# EasyEDA Pro project ProPrj_BSPD_2025-08-26.epro, board PCB1
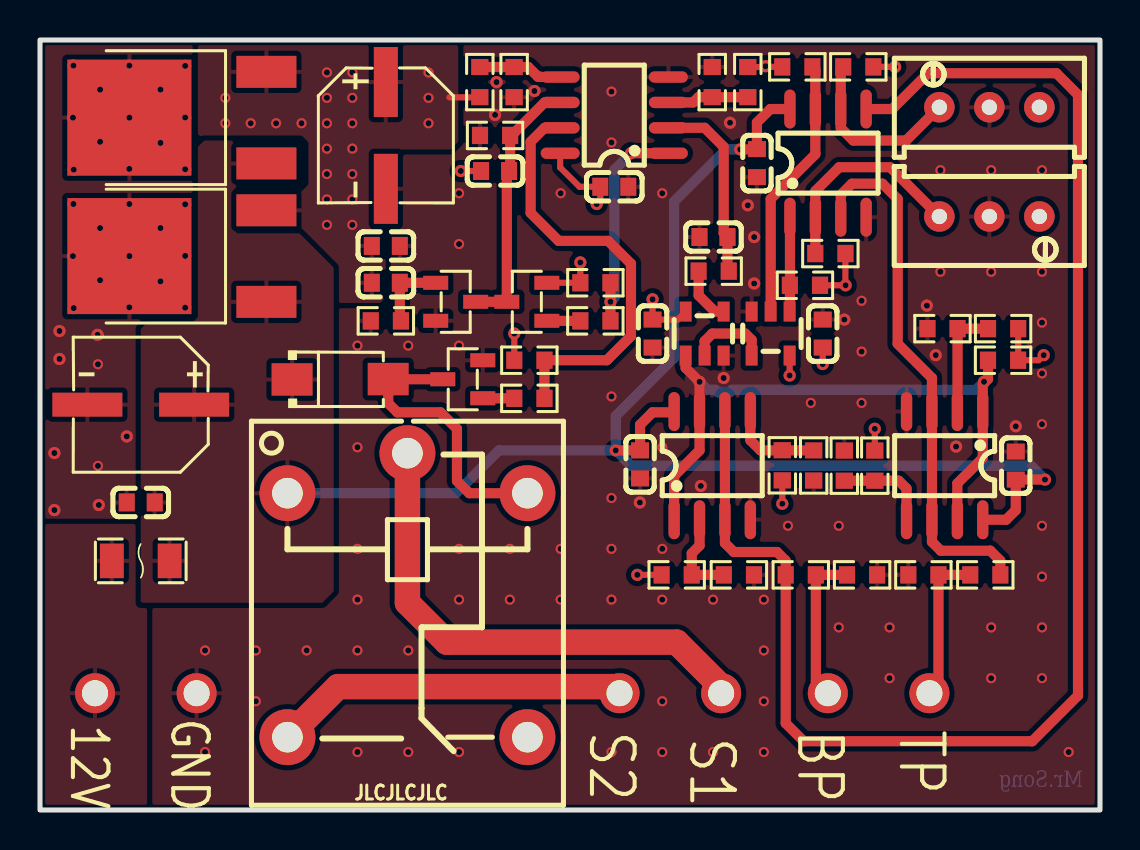
[diagram p2: board, top side]
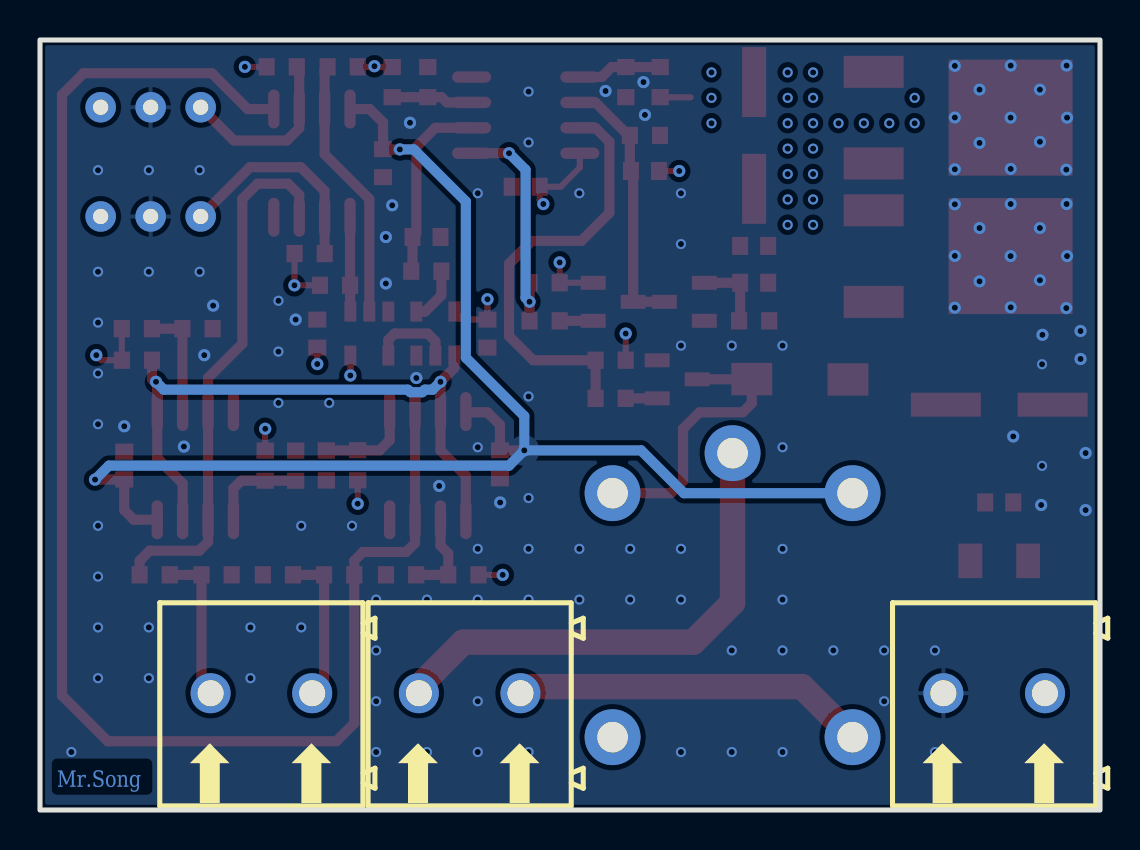
[diagram p3: board, bottom side, seen from below]

Outline 53 x 38.5 mm; copper layers: Top Layer, GND, 5V, Bottom Layer. Coordinates in mm from the lower left corner of the outline.
Outline path: rectangle 0,38.5 53,0
Stack: Top Layer 0.035mm 外层铜厚1oz / Dielectric1 0.2104mm 7628 RC49% 8.6mil / GND 0.0152mm 内层铜厚 / Dielectric2 1.065mm 1.1mm H/HOZ 含铜 / 5V 0.0152mm 内层铜厚 / Dielectric3 0.2104mm 7628 RC49% 8.6mil / Bottom Layer 0.035mm 外层铜厚1oz

## Design rules (mm)
template: 自定义配置
spacing copperThickness1oz (default): track to track 0.102, other pairs 0.152 to 0.3
spacing copperThickness2oz: track to track 0.203, other pairs 0.152 to 0.3
track width copperThickness1oz (default): min 0.127, default 0.254, max 2.54
track width copperThickness2oz: min 0.203, default 0.254, max 2.54
differential pair differentialPair (default): width min 0.127, default 0.254, max 2.54; gap min 0.152, default 0.152
via viaSize (default): diameter min 0.5, default 0.61, max 10; hole min 0.3, default 0.305, max 6.3

## Placement (name value [footprint] x y rotation side)
C1  100nF  [C0603]  48.79 17.22 90 top
C2  100nF  [C0603]  30 17.28 270 top
C5  100nF  [C0603]  5.04 15.38 0 top
C6  100nF  [C0603]  17.29 28.2 0 top
C7  100nF  [C0603]  35.85 32.34 270 top
C8  100nF  [C0603]  39.14 23.82 90 top
C9  100nF  [C0603]  30.63 23.82 270 top
C10  10uF  [C0603]  33.67 28.65 0 top
C11  100nF  [C0603]  28.71 31.16 0 top
C12  10uF  [C0603]  22.75 31.95 180 top
C13  100nF  [C0603]  17.29 26.36 180 top
C14  100uF  [CAP-SMD_BD6.3-L6.6-W6.6-LS7.4-FD]  5.04 20.27 180 top
C15  100uF  [CAP-SMD_BD6.3-L6.6-W6.6-LS7.4-FD]  17.29 33.73 270 top
D1  M4  [SMA_L4.3-W2.6-LS5.0-RD]  15.01 21.54 0 top
F1  nSMD005  [F1206]  5.04 12.46 0 top
P1  WJ500V-5.08-2P  [CONN-TH_2P-P5.00_WJ500V-5.08-2P]  5.29 5.84 0 bottom
P2  WJ500V-5.08-2P  [CONN-TH_2P-P5.00_WJ500V-5.08-2P]  41.93 5.84 0 bottom
P3  WJ500V-5.08-2P  [CONN-TH_2P-P5.00_WJ500V-5.08-2P]  31.52 5.84 0 bottom
Q1  BSS138  [SOT-23-3_L2.9-W1.3-P1.90-LS2.4-BR]  20.78 25.41 180 top
Q2  BSS84  [SOT-23-3_L2.9-W1.3-P1.90-LS2.4-BR-1]  24.34 25.41 0 top
Q3  BSS138  [SOT-23-3_L2.9-W1.3-P1.90-LS2.4-BR]  21.14 21.54 0 top
R1  100kΩ  [R0603]  48.16 24.07 0 top
R2  1kΩ  [R0603]  45.12 24.07 0 top
R3  100kΩ  [R0603]  40.22 17.22 270 top
R4  1kΩ  [R0603]  41.74 17.22 90 top
R5  100kΩ  [R0603]  31.83 11.76 180 top
R6  1kΩ  [R0603]  34.95 11.76 180 top
R7  100kΩ  [R0603]  38.68 17.23 90 top
R8  1kΩ  [R0603]  37.12 17.24 270 top
R9  10kΩ  [R0603]  48.15 22.49 0 top
R14  10kΩ  [RES-ADJ-TH_3P-L10.0-W10.0-P2.50-L]  47.47 29.68 180 top
R16  10kΩ  [RES-ADJ-TH_3P-L10.0-W10.0-P2.50-L]  47.47 35.14 0 top
R17  10kΩ  [R0603]  38.25 26.23 0 top
R18  10kΩ  [R0603]  39.52 27.82 0 top
R19  10kΩ  [R0603]  40.91 37.16 0 top
R20  10kΩ  [R0603]  37.87 37.16 180 top
R21  40.2kΩ  [R0603]  33.68 26.94 0 top
R26  39kΩ  [R0603]  35.39 36.39 90 top
R27  100kΩ  [R0603]  33.61 36.39 270 top
R28  39kΩ  [R0603]  21.99 36.39 270 top
R29  10kΩ  [R0603]  27.77 26.36 180 top
R30  10kΩ  [R0603]  23.71 36.39 90 top
R31  10kΩ  [R0603]  24.47 22.49 180 top
R32  100Ω  [R0603]  27.77 24.46 0 top
R35  1MΩ  [R0603]  22.75 33.73 0 top
R36  750kΩ  [R0603]  17.29 24.46 0 top
R37  100Ω  [R0603]  24.47 20.58 180 top
R38  10kΩ  [R0603]  47.26 11.76 0 top
R39  100kΩ  [R0603]  44.17 11.76 0 top
R40  10kΩ  [R0603]  38.04 11.76 180 top
R41  100kΩ  [R0603]  41.1 11.76 0 top
RELAY1  SRD-12VDC-SL-C  [RELAY-TH_SRD-XXVDC-XL-C]  18.37 10.74 270 top
U1  LM393DR  [SOIC-8_L5.0-W4.0-P1.27-LS6.0-BL]  45.23 17.22 180 top
U5  LM393DR  [SOIC-8_L5.0-W4.0-P1.27-LS6.0-BL]  33.61 17.22 0 top
U7  78M05  [TO-252-2_L6.6-W6.1-P4.57-LS9.9-BR-CW]  7.89 27.7 0 top
U8  SN74LVC1G00DBVR(UMW)  [SOT-23-5_L2.9-W1.6-P0.95-LS2.8-BL]  36.53 23.82 180 top
U9  SN74LVC1G00DBVR(UMW)  [SOT-23-5_L2.9-W1.6-P0.95-LS2.8-BL]  33.23 23.82 0 top
U10  LM393DR  [SOIC-8_L5.0-W4.0-P1.27-LS6.0-BL]  39.4 32.34 0 top
U11  LM393DR  [SOIC-8_L5.0-W4.0-P1.27-LS6.0-BL]  28.71 34.74 90 top
U12  78M05  [TO-252-2_L6.6-W6.1-P4.57-LS9.9-BR-CW]  7.89 34.62 0 top

## Footprints (pads in the part's own frame, mm; a bottom-side part is the same pattern mirrored in y, then rotated)
C0603
  rect 0.8x0.9 smd: 1(-0.7,0) 2(0.7,0)
CAP-SMD_BD6.3-L6.6-W6.6-LS7.4-FD
  rect 3.5x1.2 smd: 1(-2.67,0) 2(2.67,0)
CONN-TH_2P-P5.00_WJ500V-5.08-2P
  round 2 hole 1.3: 1(-2.54,0) 2(2.54,0)
F1206
  rect 1.19x1.728 smd: 1(-1.445,0) 2(1.445,0)
R0603
  rect 0.806x0.864 smd: 1(-0.753,0) 2(0.753,0)
RELAY-TH_SRD-XXVDC-XL-C
  round 2.794 hole 1.524: 1(-5.1,-6) 2(7.1,-6) 3(7.1,6) 4(-5.1,6) 5(-7.1,0)
RES-ADJ-TH_3P-L10.0-W10.0-P2.50-L
  round 1.524 hole 0.762: 1(-2.5,0) 2(0,0) 3(2.5,0)
SMA_L4.3-W2.6-LS5.0-RD
  rect 2.046x1.62 smd: 1(-2.404,-0.009) 2(2.404,0.009)
SOIC-8_L5.0-W4.0-P1.27-LS6.0-BL
  oval 0.569x1.95 smd: 1(-1.905,-2.705) 2(-0.635,-2.705) 3(0.635,-2.705) 4(1.905,-2.705) 5(1.905,2.705) 6(0.635,2.705) 7(-0.635,2.705) 8(-1.905,2.705)
SOT-23-3_L2.9-W1.3-P1.90-LS2.4-BR
  rect 1.25x0.7 smd: 1(1,-0.95) 2(1,0.95) 3(-1,0)
SOT-23-3_L2.9-W1.3-P1.90-LS2.4-BR-1
  rect 1.25x0.7 smd: 1(1,-0.95) 2(1,0.95) 3(-1,0)
SOT-23-5_L2.9-W1.6-P0.95-LS2.8-BL
  rect 0.6x1 smd: 1(-0.95,-1.1) 2(0,-1.1) 3(0.95,-1.1) 4(0.95,1.1) 5(-0.95,1.1)
TO-252-2_L6.6-W6.1-P4.57-LS9.9-BR-CW
  rect 3x1.6 smd: 1(3.424,-2.29) 3(3.424,2.29)
  rect 6.2x5.8 smd: 2(-3.424,0)

## Nets
As in the schematic.

Pads without a net: R14 1; R16 3; RELAY1 3

## Via types
v1: diameter 0.61, hole 0.305, Top Layer to Bottom Layer, 69 vias
v2: diameter 0.508, hole 0.305, Top Layer to Bottom Layer, 93 vias

## Routing (per net, layer and track width the routed paths; a pad name or vN(x,y) marks a point on that pad's centre or on a via; arc(x,y) is an arc through that point)
12V: length 70.8
  Top Layer w0.508: U1.8 48.31,14.51 48.79,15 C1.1 ; U5.8 31.67,19.89 30.63,19.89 30,19.26 C2.1 ; v1(50.25,16.52) 48.79,16.52 ; v1(35.01,33.03) 35.83,33.03 C7.1 35.85,34.38 36.52,35.05 U10.8 ; v1(28.79,17.98) 30,17.98
  Bottom Layer w0.508: v1(35.01,33.03) 34.31,33.03 31.71,30.43 31.71,22.62 28.79,19.69 v1(28.79,17.98) ; v1(28.79,17.98) 29.55,17.22 49.55,17.22 v1(50.25,16.52) ; v1(28.79,17.98) 22.94,17.98 20.81,15.84 RELAY1.1
+5V: length 27.4
  Top Layer w0.305: R1.2 48.91,22.49 R9.2 49.93,22.49 v1(50.19,22.74) ; v1(30.63,25.54) C9.1 31.88,24.52 U9.5 ; R4.2 v1(41.74,19.06) ; v1(27.02,27.38) R29.2 25.34,26.36 Q2.2 ; C8.1 v1(39.14,22.3) ; R8.2 v1(37.12,15.31) ; R26.2 36.24,37.15 v1(36.28,37.19) 36.31,37.16 R20.2 ; R17.2 v1(40.28,26.23) 40.27,26.24 R18.2 ; R28.2 21.98,35.63 20.47,35.63 ; R19.2 v1(42.76,37.16) ; 37.48,22.72 v1(37.48,21.73) ; R5.2 v1(29.87,11.76) ; v1(27.83,30.3) 28.01,30.48 C11.1 26.97,31.16 26.01,32.12 U11.8 ; R31.2 v1(23.71,23.82) ; C12.2 v1(21.04,31.95)
  vias: v2(9.27,35.61) v2(9.27,34.34) v2(10.54,34.34) v2(11.81,34.34) v2(13.08,34.34) v2(14.35,36.88) v2(14.35,35.61) v2(14.35,34.34) v2(14.35,33.07) v2(14.35,31.8) v2(14.35,30.53) v2(14.35,29.26) v2(15.62,36.88) v2(15.62,35.61) v2(15.62,34.34) v2(15.62,33.07) v2(15.62,31.8) v2(15.62,30.53) v2(15.62,29.26) v2(19.43,36.88) v2(19.43,35.61) v2(19.43,34.34)
GND:
  vias: v1(0.72,17.85) v1(0.72,15) v1(0.97,23.95) v1(0.97,22.55) v1(1.65,34.62) v1(1.65,27.7) v1(1.67,37.22) v1(1.69,32.02) v1(1.67,30.3) v1(1.69,25.1) v1(2.88,23.76) v1(2.94,15.25) v1(3,36.02) v1(3,33.41) v1(3,29.1) v1(3,26.49) v1(4.34,18.68) v1(4.47,37.22) v1(4.47,34.62) v1(4.47,32.06) v1(4.47,30.3) v1(4.47,27.7) v1(4.47,25.13) v1(6.02,36.02) v1(6.02,33.35) v1(6.02,29.1) v1(6.02,26.43) v1(7.26,37.21) v1(7.26,34.63) v1(7.26,32.04) v1(7.26,30.28) v1(7.26,27.7) v1(7.26,25.11) v1(22.83,36.39) v1(22.75,34.75) v1(24.72,35.95) v1(29.99,15.38) v1(33.04,16.2) v1(34.18,21.6) v1(34.5,34.36) v1(35.39,30.24) v1(35.71,28.65) v1(35.71,26.33) v1(40.22,24.52) v1(44.34,25.22) v1(44.79,22.74) v1(45.8,18.17) v1(48.79,19.19) v2(2.9,22.29) v2(2.9,17.21) v2(8.25,7.98) v2(8.25,2.9) v2(10.79,7.98) v2(10.79,5.44) v2(13.33,7.98) v2(15.87,23.22) v2(15.87,18.14) v2(15.87,13.06) v2(15.87,10.52) v2(15.87,7.98) v2(15.87,2.9) v2(18.41,23.22) v2(18.41,7.98) v2(18.41,2.9) v2(20.95,30.84) v2(20.95,28.3) v2(20.95,23.22) v2(20.95,13.06) v2(20.95,10.52) v2(20.95,2.9) v2(23.49,13.06) v2(23.49,10.52) v2(26.03,30.84) v2(26.03,13.06) v2(26.03,10.52) v2(28.57,35.92) v2(28.57,33.38) v2(28.57,20.68) v2(28.57,15.6) v2(28.57,13.06) v2(28.57,10.52) v2(28.57,2.9) v2(31.11,30.84) v2(31.11,18.14) v2(31.11,13.06) v2(31.11,10.52) v2(31.11,5.44) v2(31.11,2.9) v2(33.65,10.52) v2(33.65,2.9) v2(36.19,10.52) v2(36.19,7.98) v2(36.19,5.44) v2(36.19,2.9) v2(37.4,14.21) v2(38.54,20.36) v2(39.94,14.21) v2(39.94,9.13) v2(41.08,25.46) v2(41.08,22.92) v2(41.08,20.36) v2(42.48,9.13) v2(42.48,6.59) v2(45.02,31.99) v2(45.02,26.91) v2(47.56,31.99) v2(47.56,26.91) v2(47.56,9.13) v2(47.56,6.59) v2(50.1,31.99) v2(50.1,26.91) v2(50.1,24.37) v2(50.1,21.83) v2(50.1,19.29) v2(50.1,14.21) v2(50.1,11.67) v2(50.1,9.13) v2(50.1,6.59) v2(51.43,2.9)
BREAK: length 75.9
  Top Layer w0.508: U10.5 42.62,35.05 44.41,36.84 50.82,36.84 51.9,35.76 51.9,5.72 49.61,3.44 38.18,3.44 37.29,4.34 R40.2 37.29,12.46 36.85,12.9 34.69,12.9 34.25,13.34 U5.3 U5.6
SC1: length 25.2
  Top Layer w1.27: RELAY1.5 18.37,10.36 20.34,8.39 31.83,8.39 34.06,6.17 P3.2
SC2: length 17.8
  Top Layer w1.27: RELAY1.2 14.9,6.17 28.65,6.17 P3.1
TPS: length 26.9
  Top Layer w0.508: R38.2 48.02,12.46 47.52,12.96 45.04,12.96 44.6,13.41 U1.6 U1.3 44.6,21.6 42.88,23.31 42.88,30.55 42.12,31.31 40.6,31.31 40.04,30.76 U10.3
$1N548: length 5.7
  Top Layer w0.508: R1.1 R2.2 45.88,19.93 U1.2
$1N720: length 4.8
  Top Layer w0.508: U1.5 43.33,16.08 42.94,16.46 R4.1 R3.2
$1N1527: length 4.5
  Top Layer w0.508: R6.2 R5.1 32.59,12.83 32.98,13.22 U5.2
$1N1535: length 4.8
  Top Layer w0.508: R7.2 36.03,17.98 35.52,18.49 U5.5
$1N3454: length 32.3
  Top Layer w0.508: U9.1 32.28,22.11 v1(32.98,21.41) U5.7 32.98,17.98 31.71,16.71 U5.1 ; U1.7 45.87,16.33 47.14,17.6 U1.1 47.14,21.28 47.4,21.54 R9.1
  Bottom Layer w0.508: v1(32.98,21.41) 33.37,21.02 33.76,21.02 33.89,20.89 34.48,20.89 34.6,21.02 46.81,21.02 v1(47.2,21.41)
$1N3800: length 10.8
  Top Layer w0.508: R18.1 38.77,27.83 U10.2 38.77,30.95 39.96,32.14 42.5,32.14 R14.3
$1N4317: length 4.7
  Top Layer w0.508: U10.1 37.5,24.94 37.48,24.92
$1N4325: length 13.2
  Top Layer w0.508: U8.2 36.53,30.55 38.77,32.79 U10.7 38.77,37.01 R20.1
$1N4493: length 9
  Top Layer w0.508: R19.1 40.04,37.03 U10.6 40.04,34.1 40.66,33.47 43.3,33.47 R16.1
$1N4504: length 4.1
  Top Layer w0.508: U9.2 33.23,23.44 33.61,23.82 35.26,23.82 35.58,23.5 U8.4
$1N4584: length 2.8
  Top Layer w0.508: U9.4 33.74,24.92 32.93,25.73 32.93,26.94
$1N5048: length 4.2
  Top Layer w0.508: R28.1 R30.2 24.41,37.15 24.9,36.66 25.02,36.66 25.03,36.65 U11.5
$1N5249: length 4.1
  Top Layer w0.508: U11.3 32.66,35.38 32.92,35.64 R27.2 R26.1
$1N5269: length 9.5
  Top Layer w0.508: U11.2 33.23,34.11 34.18,33.16 34.18,28.84 C10.2 34.37,27.01 R21.2
$1N5671: length 11.6
  Top Layer w0.508: R32.2 v1(28.52,25.41) R29.1 ; v1(29.55,32.84) U11.1
  Bottom Layer w0.508: v1(29.55,32.84) 28.72,32.01 28.72,25.61 v1(28.52,25.41)
$1N6198: length 13.1
  Top Layer w0.508: Q1.3 Q2.3 23.34,31.84 C12.1 23.51,32 R35.2 23.58,33.73 25.23,35.38 U11.6
$1N6463: length 3.7
  Top Layer w0.508: Q1.1 18,26.36 C13.1 17.99,24.51 R36.2
$1N6650: length 1.5
  Top Layer w0.508: 23.69,20.58 22.14,20.58 Q3.1
$1N6763: length 14.3
  Top Layer w0.508: RELAY1.4 21.46,15.84 20.85,16.46 20.85,19.06 20.02,19.89 17.86,19.89 17.41,20.34 D1.2 17.42,21.54 Q3.3
$1N6823: length 21.7
  Top Layer w0.508: U11.7 25.23,34.11 24.53,33.41 24.53,29.85 25.93,28.46 28.41,28.46 29.55,27.31 29.55,23.69 28.34,22.49 R31.1 R37.1
$1N6833: length 1.7
  Top Layer w0.508: R32.1 25.34,24.46 Q2.1
$1N12992: length 7.7
  Top Layer w0.508: P2.1 38.79,6.44 R40.1 R41.1
$1N12993: length 7.7
  Top Layer w0.508: R38.1 R39.2 44.92,6.29 P2.2

## Copper pours and planes (outline as drawn; the poured copper is in the pictures)
12V on Top Layer: 5.04,10.36 5.04,24.05 5.34,24.35 7.6,24.35 7.89,24.65 7.89,33.16 8.21,33.47 12.97,33.47 13.16,33.28 13.16,31.38 12.97,31.19 9.86,31.19 9.67,31 9.67,29.03 9.86,28.84 12.97,28.84 14.69,27.12 14.69,10.93 14.12,10.36 5.04,10.36
+5V on Top Layer: 7.89,38.68 7.89,33.79 8.21,33.47 13.04,33.47 13.16,33.35 13.16,31.38 12.97,31.19 9.8,31.19 9.48,30.87 9.48,29.03 9.8,28.71 12.91,28.71 14.56,27.06 14.56,25.41 14.63,25.35 17.01,25.35 17.29,25.63 17.29,28.9 17.17,29.03 16.66,29.03 16.53,29.16 16.53,32.84 16.72,33.03 20.53,33.03 20.91,33.41 20.91,38.62 20.66,38.87 8.09,38.87
+5V on 5V: 0.26,38.24 52.74,38.24 52.74,0.26 0.26,0.26
GND on Top Layer: 0,38.5 53.68,38.5 53.68,-0.82 0,-0.82
GND on Bottom Layer: -1.06,39.57 53,39.57 53,0 -1.06,0
GND on GND: 0.26,38.24 52.74,38.24 52.74,0.26 0.26,0.26
$1N10439 on Top Layer: -0.98,14.31 -1.69,13.6 -0.93,12.84 -0.93,-0.82 5.23,-0.82 5.35,-0.94 5.35,14.17 5.22,14.31

Small or netless copper shapes (teardrops, artwork), in the pictures only: 12 on GND

## Text on the board
Bottom Layer: Mr.Song
Top Silkscreen Layer: JLCJLCJLC | 12V | GND | S2 | S1 | BP | TP
